# EAGLE design Wheel_Encoder_Adapter_Schmitt_74xx (EAGLE 7.1.0)
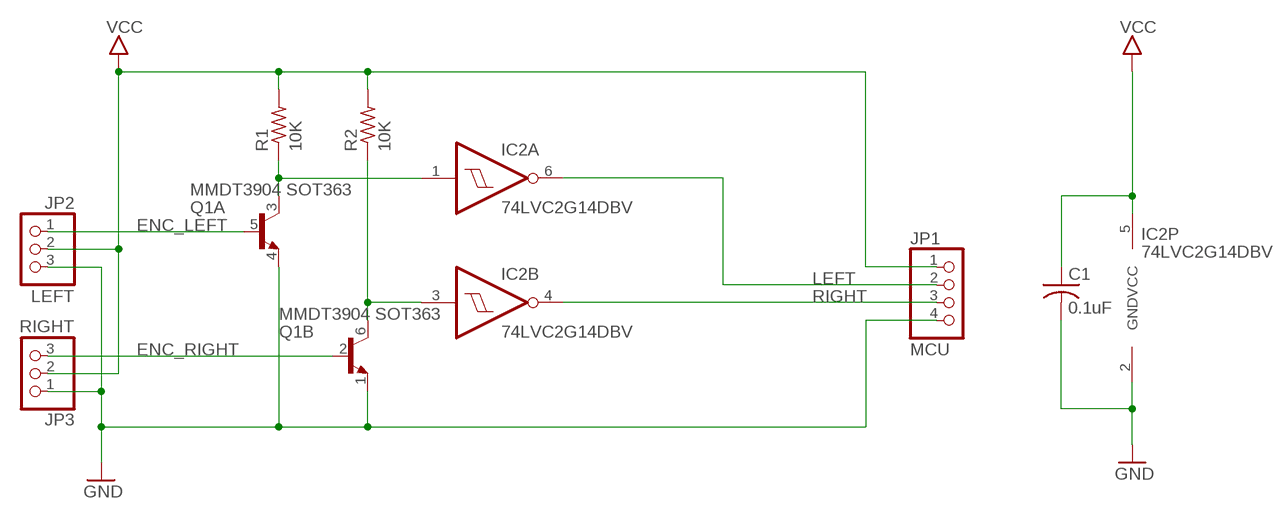
[diagram p0: schematic, sheet 1]

## Parts
C1  0.1uF  C-USC0603  [C0603]
IC2  74LVC2G14DBV  [SOT23-6]
JP1  MCU  PINHD-1X04_2.54-S  [1X04-S]
JP2  LEFT  PINHD-1X03_2.54-S  [1X03-S]
JP3  RIGHT  PINHD-1X03_2.54-S  [1X03-S]
Q1  MMDT3904 SOT363  MBT3904DW1  [SOT363]
R1  10K  R-US_R0603  [R0603]
R2  10K  R-US_R0603  [R0603]

## Nets
ENC_LEFT: JP2.1 Q1.5(A:B)
ENC_RIGHT: JP3.3 Q1.2(B:B)
GND: C1.2 IC2.2(P:GND) JP1.4 JP2.3 JP3.1 Q1.1(B:E) Q1.4(A:E)
LEFT: IC2.6(A:O) JP1.2
N$1: IC2.1(A:I) Q1.3(A:C) R1.1
N$3: IC2.3(B:I) Q1.6(B:C) R2.1
RIGHT: IC2.4(B:O) JP1.3
VCC: C1.1 IC2.5(P:VCC) JP1.1 JP2.2 JP3.2 R1.2 R2.2

## Library data of the parts
C1 = rcl:C-US: CAPACITOR, American symbol
IC2 = ads4:74LVC2G14: Texas Instruments 74LVC2G14 Dual Schmitt Trigger Inverter
JP1 = pinhead-2:PINHD-1X04: PIN HEADER
JP2 JP3 = pinhead-2:PINHD-1X03: PIN HEADER
Q1 = ads4:MBT3904DW: Dual NPN transistor SOT-363 40V 200mA
R1 R2 = rcl:R-US_: RESISTOR, American symbol

## Board
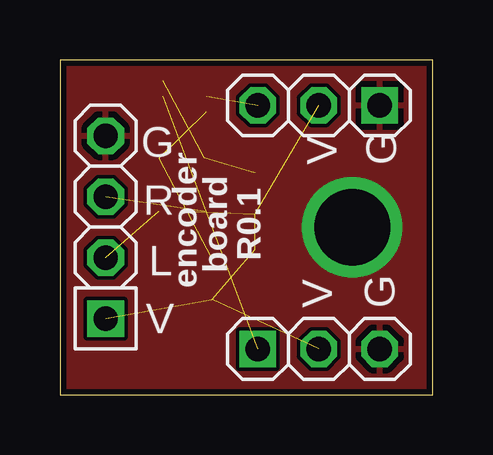
[diagram p1: board, top side]
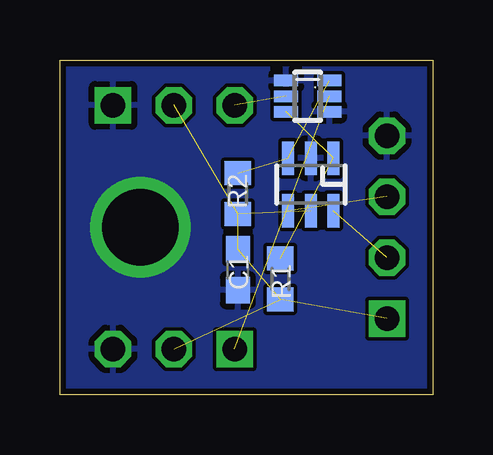
[diagram p2: board, bottom side, seen from below]

Size 15.54 x 13.96 mm. Coordinates in mm from the lower left corner, seen from the top.
Outline: 0,0 15.54,0 15.54,13.96 0,13.96 0,0
Copper layers (1*16): Top 0.0356mm / dielectric 1.5011mm / Bottom 0.0356mm
Design rules "default": minimum track width 6mil, minimum drill 13mil, track to track 6mil, track to pad 6mil, pad to pad 6mil, via to via 6mil, smd to smd 6mil, copper to edge 10mil, drill to drill 6mil, minimum pad ring 7mil, minimum via ring 7mil, stop-mask expansion 4mil, vias tented up to drill 20mil, thermal gap 10mil

### Footprints (pad centres in the part's own frame; a part is rotated, then mirrored left to right if it is on the bottom)
C0603 = smd 1.1 x 1: 1 -0.85,0; 2 0.85,0
SOT23-6 = smd 0.5 x 1.4: 1 -0.95,-1.1; 2 0,-1.1; 3 0.95,-1.1; 4 0.95,1.1; 5 0,1.1; 6 -0.95,1.1
1X04-S = drill 1.016 square: 1 -3.81,0 | drill 1.016 octagon: 2 -1.27,0; 3 1.27,0; 4 3.81,0
1X03-S = drill 1.016 square: 1 -2.54,0 | drill 1.016 octagon: 2 0,0; 3 2.54,0
SOT363 = smd 0.48 x 1: 1 -0.65,-0.65; 2 0,-0.65; 3 0.65,-0.65; 4 0.65,1.15; 5 0,1.15; 6 -0.65,1.15
R0603 = smd 1 x 1.1: 1 -0.85,0; 2 0.85,0

### Placement (x,y rotation side)
C1  8.13,5.21 270 bottom
IC2  5.08,8.76 180 bottom
JP1  1.91,6.99 90 top
JP2  10.79,1.91 0 top
JP3  10.79,12.06 180 top
Q1  5.46,12.45 270 bottom
R1  6.35,4.83 270 bottom
R2  8.13,8.38 270 bottom

### Tracks (layer width: path | path; a pad name or v marks a point on that pad's centre or on a via)
ENC_LEFT  (1 unrouted)
ENC_RIGHT  (1 unrouted)
GND  (via drill 3.17)
  other vias: 12.19,6.99
  pour Top (rank 2): 0,13.97 15.56,13.97 15.56,0 0,0
  pour Bottom: 0,0 15.56,0 15.56,13.97 0,13.97
LEFT  (1 unrouted)
N$1  (2 unrouted)
N$3  (2 unrouted)
RIGHT  (1 unrouted)
VCC  (6 unrouted)

### Text on the board
tNames: G | V | G | R | L | R0.1 | board | V | encoder | V | G
tsilk: V | R | G | G | C1 | R | L | V | C2 | L | V | G
bsilk: encoder | board | R0.4